# Altium project PorTeL_beacon_board.PrjPcb
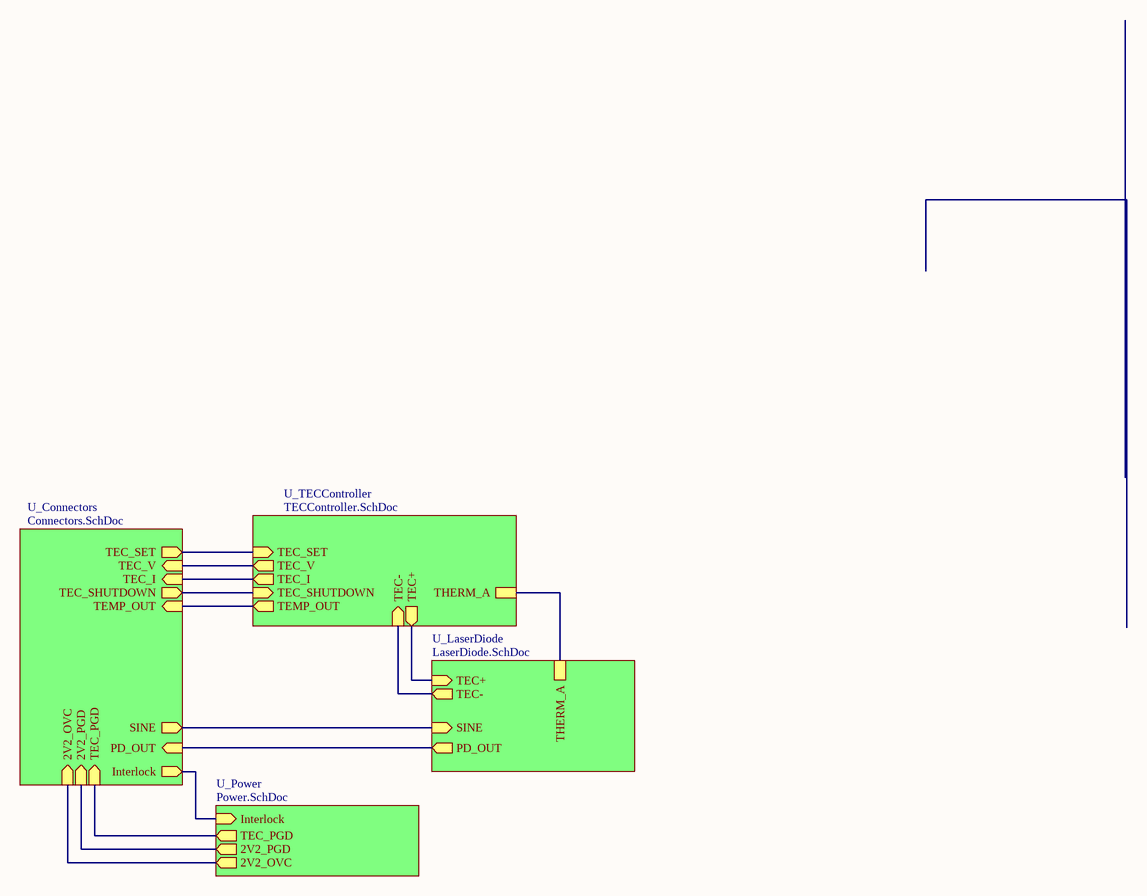
[diagram p0: Top.SchDoc]
drawnby: Nicholas Belsten; Revision: V2.1; title: PorTel-Beacon
5 sheets, 134 parts. Net scope: hierarchical (ports join the sheet entries above them; power ports are global).
Board file: PCB_power.PcbDoc
Sheets:
  Top.SchDoc
    U_Connectors = Connectors.SchDoc
    U_LaserDiode = LaserDiode.SchDoc
    U_Power = Power.SchDoc
    U_TECController = TECController.SchDoc

## Sheet Top.SchDoc: PorTel-Beacon
size Letter; Organization: MIT; SheetNumber: 1; SheetTotal: 5; Section: Section

### Sub-sheets
U_Connectors = Connectors.SchDoc: Interlock (out), SINE (out), TEC_SHUTDOWN (out), PD_OUT (in), TEMP_OUT (in), TEC_I (in), TEC_V (in), TEC_SET (out), 2V2_PGD (in), 2V2_OVC (in), TEC_PGD (in)
U_LaserDiode = LaserDiode.SchDoc: PD_OUT (out), TEC+ (in), TEC- (out), SINE (in), THERM_A
U_Power = Power.SchDoc: Interlock (in), TEC_PGD (out), 2V2_OVC (out), 2V2_PGD (out)
U_TECController = TECController.SchDoc: TEC_I (out), TEC_V (out), TEC_SET (in), TEC+ (out), TEC- (in), TEC_SHUTDOWN (in), TEMP_OUT (out), THERM_A

### Nets
IN2p: sheet U_Connectors/TEC_SET, sheet U_TECController/TEC_SET
OUT1: sheet U_Connectors/TEMP_OUT, sheet U_TECController/TEMP_OUT
OVC: sheet U_Connectors/2V2_OVC, sheet U_Power/2V2_OVC
NetC1_1: sheet U_Connectors/PD_OUT, sheet U_LaserDiode/PD_OUT
NetC54_2: sheet U_LaserDiode/TEC+, sheet U_TECController/TEC+
NetC55_2: sheet U_LaserDiode/TEC-, sheet U_TECController/TEC-
NetJ6_1: sheet U_Connectors/Interlock, sheet U_Power/Interlock
NetR2_2: sheet U_Connectors/SINE, sheet U_LaserDiode/SINE
NetR34_1: sheet U_LaserDiode/THERM_A, sheet U_TECController/THERM_A
NetR55_2: sheet U_Connectors/TEC_SHUTDOWN, sheet U_TECController/TEC_SHUTDOWN
NetR65_1: sheet U_Connectors/TEC_PGD, sheet U_Power/TEC_PGD
NetR69_1: sheet U_Connectors/2V2_PGD, sheet U_Power/2V2_PGD
NetU3_20: sheet U_Connectors/TEC_V, sheet U_TECController/TEC_V
NetU3_21: sheet U_Connectors/TEC_I, sheet U_TECController/TEC_I

### Notes on the sheet
- Title
- Size
- Date
- Letter
- Section
- Time
- Sheet
- of
- Revision
- Drawn
- 33-207 / 77 Mass. Ave.
- Cambridge, MA 02139
- File

## Sheet Connectors.SchDoc: PorTel-Beacon
size Letter; Organization: MIT; SheetNumber: 2; SheetTotal: 5; Section: Connectors
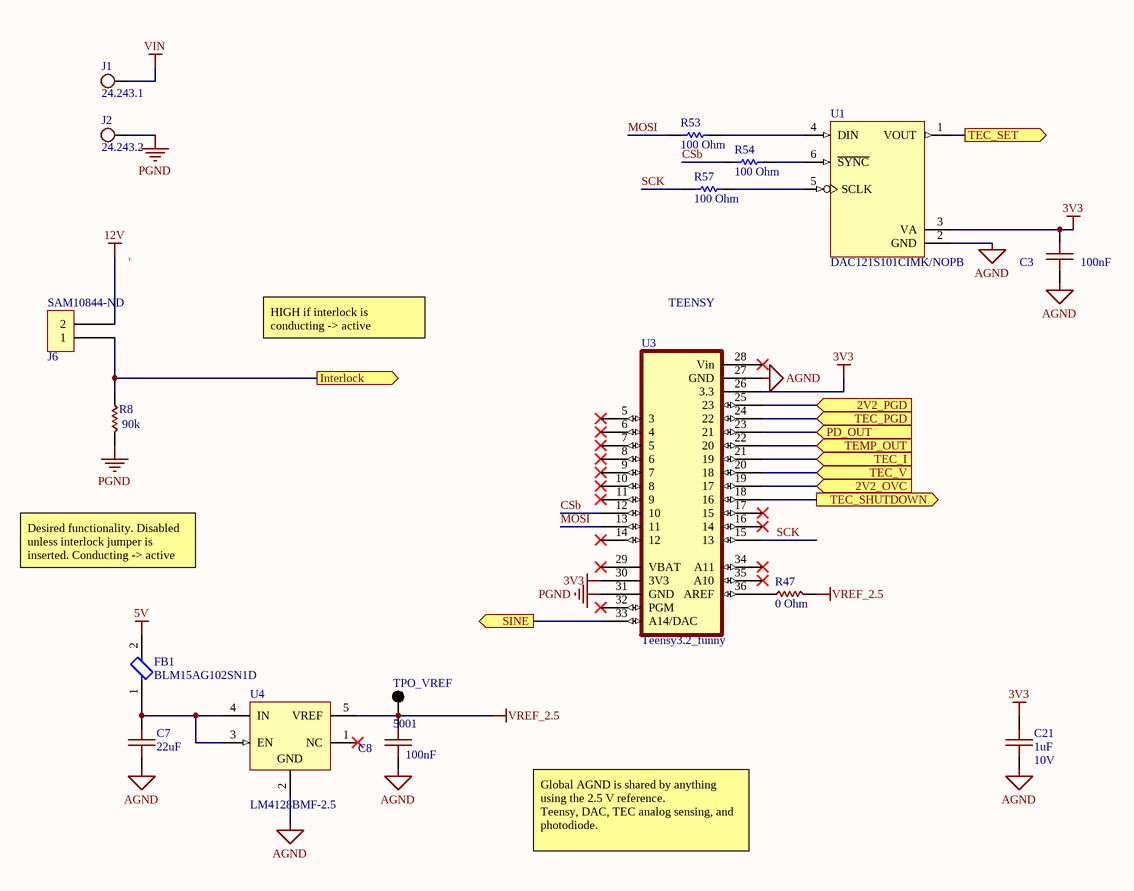
[diagram p1: Connectors.SchDoc]

### Parts
C3  100nF  [0603 B]
C7  22uF  [1210]
C8  100nF  [0603 B]
C21  1uF  Voltage: 10V  [0603 B]
FB1  BLM15AG102SN1D  [FP-BLM15-MFG]
J1  24.243.1  [BANANA RD]  (no BOM)
J2  24.243.2  [BANANA BK]  (no BOM)
J6  Supplier Part Number 1: SAM10844-ND  [SIL02]  (hidden comment: SIL02)
R8  90k  [0603]
R47  0 Ohm  [0603]
R53  100 Ohm  [RESC1608X55X30LL15T15]
R54  100 Ohm  [RESC1608X55X30LL15T15]
R57  100 Ohm  [RESC1608X55X30LL15T15]
TPO_VREF  5001  [KSTN-5001]
U1  DAC121S101CIMK/NOPB  [MK06A_N]
U3  Teensy3.2_funny  [Teensy32_funny]
U4  LM4128BMF-2.5  [DBV0005A_N]

### Ports
2V2_OVC (in), 2V2_PGD (in), Interlock (out), PD_OUT (in), SINE (out), TEC_I (in), TEC_PGD (in), TEC_SET (out), TEC_SHUTDOWN (out), TEC_V (in), TEMP_OUT (in)

### Nets
3V3: C3.1 C21.2 U1.3(VA) U3.26(3.3) U3.30(3V3)
5V: FB1.2
12V: J6.2
AGND: C3.2 C7.2 C8.2 C21.1 U1.2(GND) U3.27(GND) U4.2(GND)
PGND: J2.1(TP) R8.1 U3.31(GND)
VIN: J1.1(TP)
VREF_2.5: C8.1 R47.1 TPO_VREF.1 U4.5(VREF)
CSb: R54.1 U3.12(10)
IN2p: U1.1(VOUT) ; port TEC_SET
MOSI: R53.1 U3.13(11)
OUT1: U3.22(20) ; port TEMP_OUT
OVC: U3.19(17) ; port 2V2_OVC
SCK: R57.1 U3.15(13)
NetC1_1: U3.23(21) ; port PD_OUT
NetC7_1: C7.1 FB1.1 U4.3(EN) U4.4(IN)
NetJ6_1: J6.1 R8.2 ; port Interlock
NetR2_2: U3.33(A14/DAC) ; port SINE
NetR47_2: R47.2 U3.36(AREF)
NetR53_2: R53.2 U1.4(DIN)
NetR54_2: R54.2 U1.6(~{SYNC})
NetR55_2: U3.18(16) ; port TEC_SHUTDOWN
NetR57_2: R57.2 U1.5(SCLK)
NetR65_1: U3.24(22) ; port TEC_PGD
NetR69_1: U3.25(23) ; port 2V2_PGD
NetU3_20: U3.20(18) ; port TEC_V
NetU3_21: U3.21(19) ; port TEC_I

Not connected (* = marked no-connect by the designer): U3 5(3)* 6(4)* 7(5)* 8(6)* 9(7)* 10(8)* 11(9)* 14(12)* 16(14)* 17(15)* 28(Vin)* 29(VBAT)* 32(PGM)* 34(A11)* 35(A10)*; U4 1(NC)*

### Notes on the sheet
- '
- HIGH if interlock is conducting -> active
- TEENSY
- Desired functionality. Disabled unless interlock jumper is inserted. Conducting -> active
- Global AGND is shared by anything using the 2.5 V reference.
  Teensy, DAC, TEC analog sensing, and photodiode.
- Title
- Size
- Date
- Letter
- Section
- Time
- Sheet
- of
- Revision
- Drawn
- 33-207 / 77 Mass. Ave.
- Cambridge, MA 02139
- File

### Library data of the parts
C3 C8 = CAP 0603: 603 Capacitor; Value: 100nF
C7 = CAP 1210: 1210 Capacitor; Value: 22uF
C21 = CAP 0603: 603 Capacitor; Ref: C1608X7R1E105M080AB; Rating: X7R; Value: 1uF
FB1 = CMP-0686-00181-4: FERRITE BEAD 1 KOHM 0402 1LN; Manufacturer: Murata; 3DS Part Number: 310-00007; Impedance At Frequency: 1kΩ @ 100MHz; Tolerance: 25%; Series Resistance: 650mΩ; Test Frequency: 100MHz; Rms Current: 300mA; Manufacturer Part Number: BLM15AG102SN1D; Octopart: https://octopart.com/blm15ag102sn1d-murata-368316; RoHS: TRUE; Ipc Land Pattern Name: CAPC10050X50; Temperature Range High: +125°C; ComponentLink2Description: Datasheet; Device Class L1: Passive Components; Package: BLM15; Temperature Range Low: -55°C; Core Material: Ferrite; ComponentLink2URL: https://www.murata.com/en-us/products/productdata/8796740059166/ENFA0018.pdf?1514431813000; Mouser Description: Ferrite Beads 1K OHM HIGH SPEED SI; Digikey Description: FERRITE BEAD 1 KOHM 0402 1LN; Temperature: -55°C to +125°C; Category: FBead; Device Class L3: Ferrite Beads and Chips; Device Class L2: EMI / RFI Components; Automotive: No; Height: 0.55mm; Lead Free: Yes
J1 = BANANA RED: Banana jack, PCB mount right angle; Ref: 24.243.1
J2 = BANANA BLACK: Banana jack, PCB mount right angle; Ref: 24.243.2
J6 = SIL02: Conn Unshrouded Header HDR 2 POS 2.54mm Solder ST Top Entry Thru-Hole Bag; Manufacturer: Samtec; Manufacturer Part Number: TSW-102-07-F-S; Ref: 4x1 2.54MM HEADER; Number of Contacts: 2; Gender: Male; Max Current Rating: 7.6A; Max Voltage Rating (AC): 550V; Supplier 1: Digi-Key; RoHS: Yes; Category: Headers and Wire Housings; Stock 1: 35041; Pricing 1: 1=0.30000, 10=0.25500, 100=0.19800, 500=0.16968, 1000=0.14140, 5000=0.12120, 10000=0.11312 (USD); Mount: Through Hole; Contact Plating: Gold; Contact Material: Bronze; Color: Black; Housing Color: Black; Housing Material: Polyester; Contact Shape: Square; Contact Finish - Mating: GOLD; Insulation Material: PBT; Insulation Color: Black; Min Operating Temperature: -55°C; Max Operating Temperature: 125°C; Number of Rows: 1; Termination: Solder; Packaging: Bag; Number of Positions: 2; Orientation: Straight; Connector Type: Header; Fastening Type: Pull; Series: TSW; Contact Type: Male Pin; Package Quantity: 1; Length: 5.08mm; Pitch: 2.54mm; Contact Mating Length: 0.23inch; Depth: 2.54mm; Radiation Hardening: No; RoHS Compliant: Yes; Reach SVHC Compliant: Yes; Flammability Rating: UL94 V-0; ComponentLink1URL: https://datasheet.ciiva.com/739/tsw-xxx-xx-xxx-x-xx-xxx-mkt-739881.pdf?src-supplier=Digi-Key; ComponentLink1Description: https://datasheet.ciiva.com/739/tsw-xxx-xx-xxx-x-xx-xxx-mkt-739881.pdf?src-supplier=Digi-Key; ComponentLink2URL: https://datasheet.ciiva.com/10281/htsw-th-10281262.pdf?src-supplier=Avnet; ComponentLink2Description: https://datasheet.ciiva.com/10281/htsw-th-10281262.pdf?src-supplier=Avnet
R8 R47 = RES 0603: 603 Resistor
  R8: Value: 90k
  R47: Value: 0 Ohm
R53 R54 R57 = CMP-2000-00179-1: Manufacturer: Panasonic; Part Number: ERJ-3EKF1000V
TPO_VREF = CMP-2000-05181-1: Test Point, Black, 1-Pin THD, RoHS, Bulk; Manufacturer: Keystone; Other Names: 5001K; Catalog Drawings: 5000Series; Alternate Color: 5004K-ND / -TESTPOINTPCMINI.040"DYELLOW / 5003K-ND / -TESTPOINTPCMINI.040"DORANGE / 5002K-ND / -TESTPOINTPCMINI.040"DWHITE / 5000K-ND / -TESTPOINTPCMINI.040"DRED; Kits: DKTGRS232C-KIT-ND / -TTLCONVERTER; Online Catalog: ColorCodedTestPoints; Datasheet URL: https://ciiva.com/datasheet-click-2917627?src=ciiva&sig=bd195616; Mounting Type: 0.040"(1.02mm)HoleDiameter; Family: TestPoints; RoHS Information: RoHSComplianceStatement; Datasheet Version: Rev. G, 12/2008; Color: Black; Category: TestandMeasurement; Standard Package: 100; Manufacturer URL: http://www.keyelco.com/; Material: Base,Nylon46,UL94V-0; Type: PCTestPoint,Miniature; Terminal: 0.010"x0.020"(0.25mmx0.51mm)PhosphorBronzeWire,SilverPlated; Series: THM; Packaging: Bulk
U1 = CMP-0061-00064-2: 12-Bit Micro Power, RRO Digital-to-Analog Converter, 6-pin Tiny SOT23, Pb-Free; Manufacturer: National Semiconductor; PackageTopMarking: X61C*XTT; CompType: D/A Converter; PowerWise: Y; PinCount: 6; ComponentLink1URL: http://www.national.com/ds/DA/DAC121S101.pdf; Code_JEDEC: MO-193-AA; Code_IPC: SOT26A-6; PackageReference: MK06A; ComponentLink2Description: DAC121S101 Web Page; PackageDescription: Molded TSOT, 2.97 x 1.65 x 0.87mm Body, 6 Lead, 0.95mm Pitch; ComponentLink3Description: MK06A Package Page; ComponentLink1Description: DAC121S101 Datasheet; RoHS: Y; ComponentLink3URL: http://www.national.com/packaging/folders/mk06a.html; PackageVersion: revE, Nov-2008; RevisionNote: Component URLs added; DatasheetVersion: Feb-2010; ComponentLink2URL: http://www.national.com/pf/DA/DAC121S101.html
U4 = CMP-0074-00275-3: Precision Micropower Series Voltage Reference, 5-pin SOT-23; Manufacturer: Texas Instruments; CompType: Voltage Reference IC; PowerWise: Y; PackageTopMarking: R5CB*XTT; PinCount: 5; ComponentLink1Description: Datasheet; PackageReference: DBV0005A; PackageDescription: Molded SOT-23, .115 x .063 x .040 in Body, 5 Lead, .0375 in Pitch; ComponentLink1URL: http://www.ti.com/general/docs/lit/getliterature.tsp?genericPartNumber=LM4128&fileType=pdf; RevisionNote: Component URLs added; DatasheetVersion: Nov-2006; RoHS: N; PackageVersion: revD, Aug-2008

## Sheet LaserDiode.SchDoc: PorTel-Beacon
size Tabloid; Organization: MIT; SheetNumber: 4; SheetTotal: 5; Section: Laser Diode
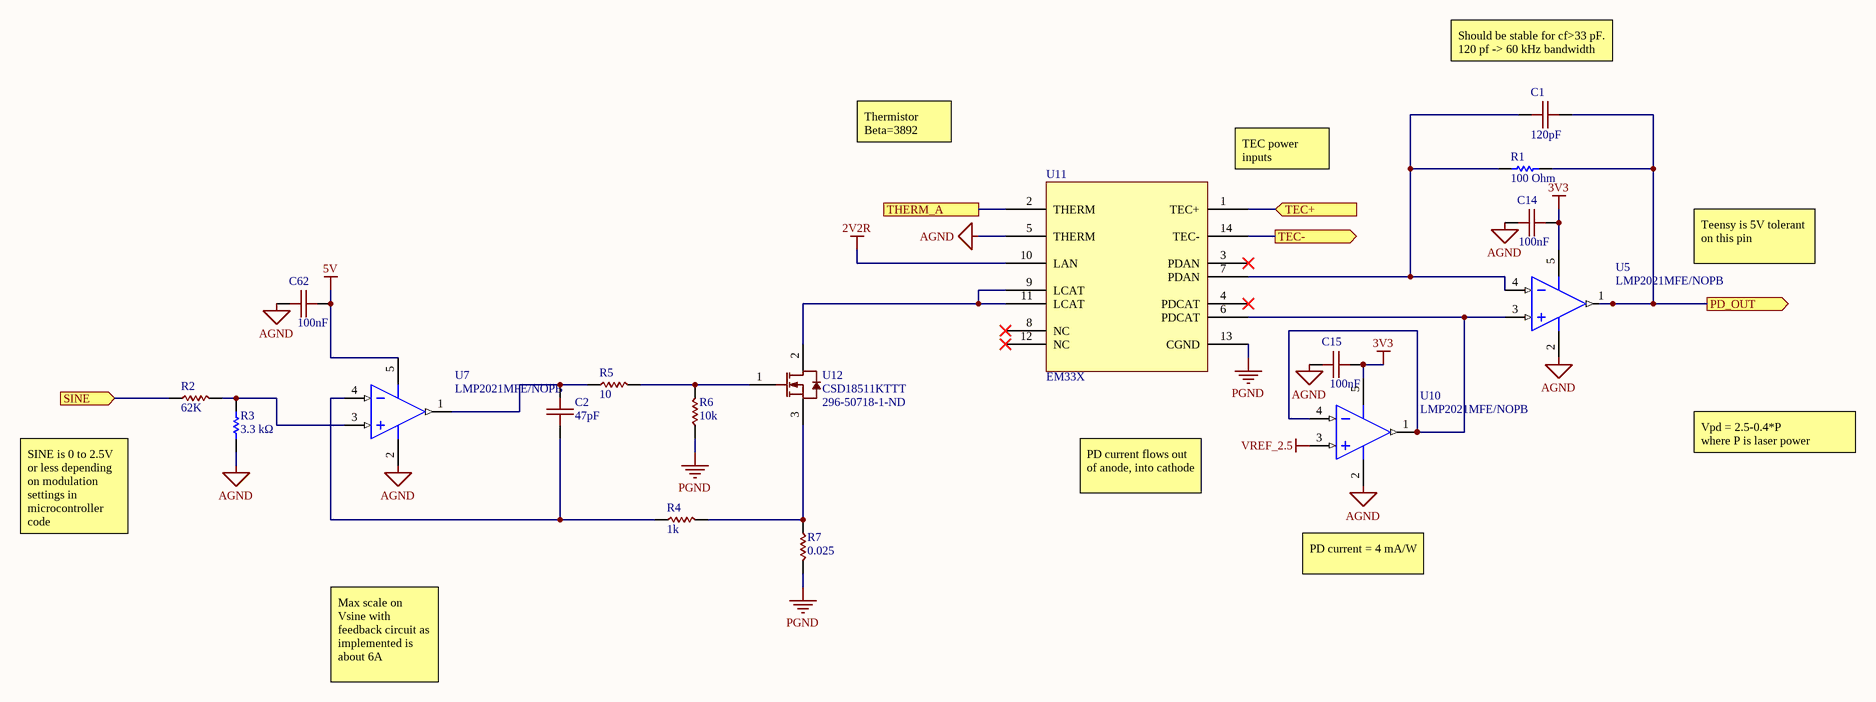
[diagram p2: LaserDiode.SchDoc]

### Parts
C1  120pF  [0603 B]
C2  47pF  [0603 B]
C14  100nF  [0603 B]
C15  100nF  [0603 B]
C62  100nF  [0603 B]
R1  100 Ohm  [RESC1608X55X30LL15T15]
R2  62K  [0805]
R3  3.3 kΩ  [RESC2013X70X40ML20T20]
R4  1k  [0805]
R5  10  [0805]
R6  10k  [0805]
R7  0.025  [1206]
U5  LMP2021MFE/NOPB  [DBV0005A_N]
U7  LMP2021MFE/NOPB  [DBV0005A_N]
U10  LMP2021MFE/NOPB  [DBV0005A_N]
U11  EM33X  [EM33X]
U12  CSD18511KTTT  Supplier Part Number 1: 296-50718-1-ND  [DPAK254P1510X470-3N]

### Ports
PD_OUT (out), SINE (in), TEC+ (in), TEC- (out), THERM_A

### Nets
2V2R: U11.10(LAN)
3V3: C14.1 C15.1 U5.5(V+) U10.5(V+)
5V: C62.1 U7.5(V+)
AGND: C14.2 C15.2 C62.2 R3.1 U5.2(V-) U7.2(V-) U10.2(V-) U11.5(THERM)
PGND: R6.2 R7.1 U11.13(CGND)
VREF_2.5: U10.3(IN+)
NetC1_1: C1.1 R1.2 U5.1(OUT) ; port PD_OUT
NetC1_2: C1.2 R1.1 U5.4(IN-) U11.7(PDAN)
NetC2_1: C2.1 R4.2 U7.4(IN-)
NetC2_2: C2.2 R5.2 U7.1(OUT)
NetC54_2: U11.1(TEC+) ; port TEC+
NetC55_2: U11.14(TEC-) ; port TEC-
NetR2_1: R2.1 R3.2 U7.3(IN+)
NetR2_2: R2.2 ; port SINE
NetR4_1: R4.1 R7.2 U12.3(S)
NetR5_1: R5.1 R6.1 U12.1(G)
NetR34_1: U11.2(THERM) ; port THERM_A
NetU5_3: U5.3(IN+) U10.1(OUT) U10.4(IN-) U11.6(PDCAT)
NetU11_9: U11.9(LCAT) U11.11(LCAT) U12.2(D)

Not connected (* = marked no-connect by the designer): U11 3(PDAN)* 4(PDCAT)* 8(NC)* 12(NC)*

### Notes on the sheet
- Should be stable for cf>33 pF. 120 pf -> 60 kHz bandwidth
- Thermistor Beta=3892
- (near U11) TEC power inputs
- Teensy is 5V tolerant on this pin
- Vpd = 2.5-0.4*P
  where P is laser power
- SINE is 0 to 2.5V or less depending on modulation settings in microcontroller code
- PD current flows out of anode, into cathode
- PD current = 4 mA/W
- Max scale on Vsine with feedback circuit as implemented is about 6A
- Title
- Size
- Date
- Tabloid
- Section
- Time
- Sheet
- of
- Revision
- Drawn
- 33-207 / 77 Mass. Ave.
- Cambridge, MA 02139
- File

### Library data of the parts
C1 = CAP 0603: Cap Ceramic 120pF 50V C0G 5% SMD 0603 125°C Paper T/R; Manufacturer: KEMET; Manufacturer Part Number: C0603C121J5GACTU; Dissipation Factor: 0.1%; Temperature Coefficient: 30ppm/°C; Value: 120pF; Supplier 1: Digi-Key; Supplier Part Number 1: 399-C0603C121J5GAC7867CT-ND; RoHS: Yes; Category: Ceramic Capacitors; Stock 1: 134212; Pricing 1: 1=0.10000, 10=0.04900, 50=0.02660, 100=0.02180, 500=0.01556, 1000=0.01222 (USD); Mount: Surface Mount,PCB; Case/Package: 0603; Number of Pins: 2; Case Code (Metric): 1608; Case Code (Imperial): 0603; Dielectric Material: Ceramic; Contact Material: Tin; Contact Plating: Tin,Matte; Min Operating Temperature: -55°C; Max Operating Temperature: 125°C; Capacitance: 120pF; Tolerance: 5%; Voltage Rating: 50V; Voltage Rating (DC): 50V; Packaging: Tape and Reel; Dielectric: C0G; Series: C; Package Quantity: 1; Termination: SMD/SMT; Construction: Flat; Voltage: 50V; Length: 1.6mm; Width: 0.8mm; Height: 0.8mm; Thickness: 0.034inch; Depth: 0.8mm; Lead Pitch: 0.7mm; Radiation Hardening: No; RoHS Compliant: Yes; Lead Free: Lead Free; Reach SVHC Compliant: Yes; ComponentLink1URL: https://datasheet.ciiva.com/144/docfinderpartnumber-c0603c121j5gactu-144406.pdf?src-supplier=Digi-Key; ComponentLink1Description: https://datasheet.ciiva.com/144/docfinderpartnumber-c0603c121j5gactu-144406.pdf?src-supplier=Digi-Key; ComponentLink2URL: https://datasheet.ciiva.com/14610/70095383-14610090.pdf?src-supplier=Allied+Electronics; ComponentLink2Description: https://datasheet.ciiva.com/14610/70095383-14610090.pdf?src-supplier=Allied+Electronics; ComponentLink3URL: https://datasheet.ciiva.com/5417/kem-c1003-c0g-smd-356956-5417613.pdf?src-supplier=Mouser; ComponentLink3Description: https://datasheet.ciiva.com/5417/kem-c1003-c0g-smd-356956-5417613.pdf?src-supplier=Mouser; ComponentLink4URL: https://datasheet.ciiva.com/18192/getdatasheetpartid-462848-18192773.pdf?src-supplier=Verical; ComponentLink4Description: https://datasheet.ciiva.com/18192/getdatasheetpartid-462848-18192773.pdf?src-supplier=Verical
C2 C14 C15 C62 = CAP 0603: 603 Capacitor
  C2: Value: 47pF
  C14 C15 C62: Value: 100nF
R1 = CMP-2000-00179-1: as R53 on sheet Connectors
R2 R4-R6 = RES 0805: 805 Resistor
  R2: Value: 62K
  R4: Value: 1k
  R5: Value: 10
  R6: Value: 10k
R3 = CMP-2001-00533-1: Manufacturer: Panasonic; Part Number: ERJ6ENF3301V; Resistance: 3.3 kΩ
R7 = RES 1206: 1206 Resistor; Value: 0.025
U5 U7 U10 = CMP-0055-01233-3: Zero Drift, Low Noise, EMI Hardened Amplifier, 5-pin SOT-23, Pb-Free; Manufacturer: Texas Instruments; PowerWise: N; CompType: Amplifiers; PackageTopMarking: AF5A*XTT; PackageDescription: Molded SOT-23, .115 x .063 x .040 in Body, 5 Lead, .0375 in Pitch; PinCount: 5; RoHS: Y; Package Reference: DBV0005A; ComponentLink1URL: http://www.ti.com/general/docs/lit/getliterature.tsp?genericPartNumber=LMP2021&fileType=pdf; ComponentLink1Description: Datasheet URL
U11 = EM33X: 5W Cooled 9XX Multimode Lasers in 14-Pin Package
U12 = CSD18511KTT: 40-V, N channel NexFET™ power MOSFET, single D2PAK, 2.6 mOhm; Vendor: Texas Instruments; Built_By: EMA_Jessica; SourceLibrary: TI_2019-05-10; Manufacturer_Part_Number: CSD18511KTT; Copyright: Copyright (C) 2018 Accelerated Designs. All rights reserved; RefDes: RefDes; Type: DEV; Supplier 1: Digi-Key

## Sheet Power.SchDoc: PorTel-Beacon
size C; Organization: MIT; SheetNumber: 3; SheetTotal: 5; Section: Power
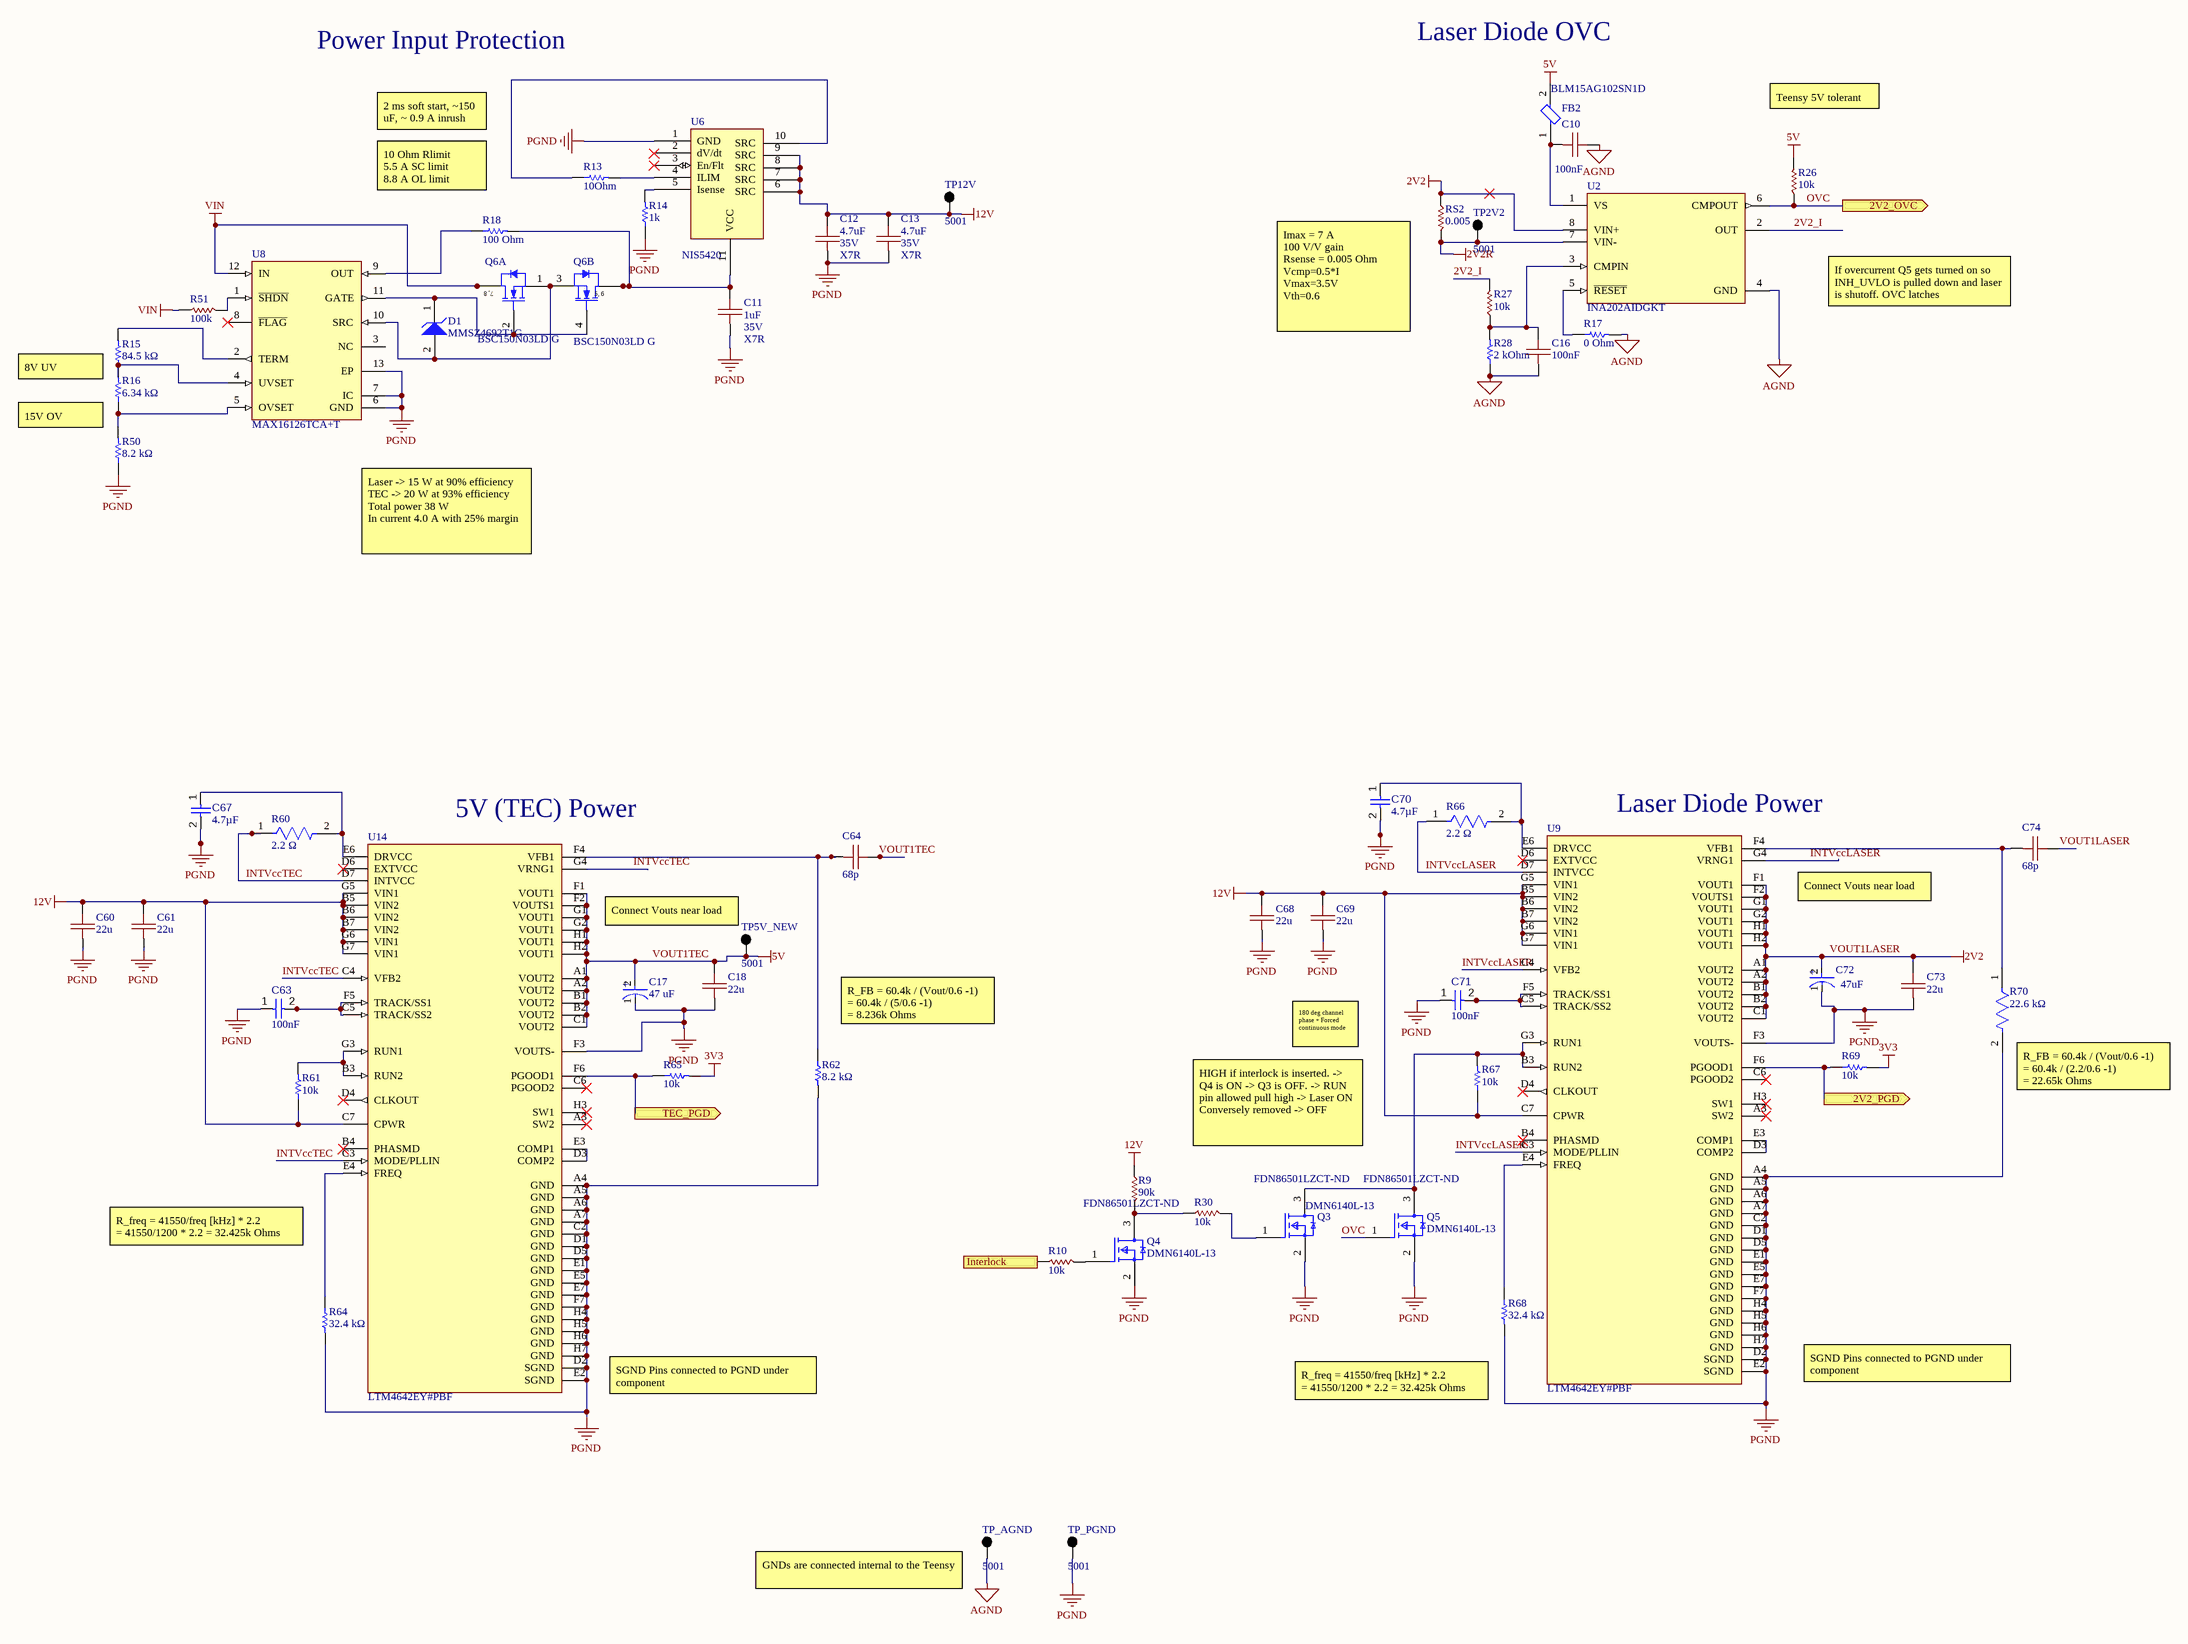
[diagram p3: Power.SchDoc]

### Parts
C10  100nF  [0603 B]
C11  1uF  Voltage: 35V  Type: X7R  [0805 B]
C12  4.7uF  Voltage: 35V  Type: X7R  [0805 B]
C13  4.7uF  Voltage: 35V  Type: X7R  [0805 B]
C16  100nF  [0603 B]
C17  47 uF  [FP-T491D476K025AT-MFG]
C18  22u  [1210]
C60  22u  [1210]
C61  22u  [1210]
C63  value 100nF  [CAPC1005X56X25LL10T15]  (hidden comment: Capacitor 0.1 uF +/- 5% 16 V 0402)
C64  68p  [0805 B]
C67  value 4.7µF  [CAPC0805(2012)145_L]  (hidden comment: Capacitor 4.7µF +/-40% 25V 0805)
C68  22u  [1210]
C69  22u  [1210]
C70  value 4.7µF  [CAPC0805(2012)145_L]  (hidden comment: Capacitor 4.7µF +/-40% 25V 0805)
C71  value 100nF  [CAPC1005X56X25LL10T15]  (hidden comment: Capacitor 0.1 uF +/- 5% 16 V 0402)
C72  Capacitance: 47uF  [FP-T491D476K025AT-MFG]  (hidden comment: 47 uF)
C73  22u  [1210]
C74  68p  [0805 B]
D1  MMSZ4692T1G  [ONSC-SOD-123-2-425-04_V]
FB2  BLM15AG102SN1D  [FP-BLM15-MFG]
Q3  DMN6140L-13  Supplier Part Number 2: FDN86501LZCT-ND  [FP-SOT23-MFG]
Q4  DMN6140L-13  Supplier Part Number 2: FDN86501LZCT-ND  [FP-SOT23-MFG]
Q5  DMN6140L-13  Supplier Part Number 2: FDN86501LZCT-ND  [FP-SOT23-MFG]
Q6  BSC150N03LD G  [INF-PG-TDSON-8-4_V]  (parts A,B of 2)
R9  90k  [0603]
R10  10k  [0603]
R13  10Ohm  [RESC1608X55X25NL10T15]
R14  1k  [RESC1608X55X30LL20T20]
R15  84.5 kΩ  [RESC1609X50X30NL10T20]
R16  6.34 kΩ  [RESC1608X55X30NL15T15]
R17  0 Ohm  [RESC1608X55X25ML10T15]
R18  100 Ohm  [RESC1608X55X30LL15T15]
R26  10k  [0603]
R27  10k  [0805]
R28  2 kOhm  [RESC1608X55X30ML15T15]
R30  10k  [0603]
R50  8.2 kΩ  [RESC1609X50X30NL10T20]
R51  100k  [0603]
R60  2.2 Ω  [FP-CRCW0603-HPe3-IPC_A]
R61  10k  [RESC1608X55X30LL20T20]
R62  8.2 kΩ  [RESC1609X50X30ML10T20]
R64  32.4 kΩ  [RESC1609X50X30LL10T20]
R65  10k  [RESC1608X55X30LL20T20]
R66  2.2 Ω  [FP-CRCW0603-HPe3-IPC_A]
R67  10k  [RESC1608X55X30LL20T20]
R68  32.4 kΩ  [RESC1609X50X30LL10T20]
R69  10k  [RESC1608X55X30LL20T20]
R70  22.6 kΩ  [FP-CRCW0402-e3-IPC_C]
RS2  0.005  [1206]
TP2V2  5001  [KSTN-5001]
TP5V_NEW  5001  [KSTN-5001]
TP12V  5001  [KSTN-5001]
TP_AGND  5001  [KSTN-5001]
TP_PGND  5001  [KSTN-5001]
U2  INA202AIDGKT  [FP-DGK0008A-IPC_A]
U6  NIS5420  [SON50P300X10_HS-11N]
U8  MAX16126TCA+T  [T1233+4_N]
U9  LTM4642EY#PBF  [FP-BGA-56-05-08-1961-MFG]
U14  LTM4642EY#PBF  [FP-BGA-56-05-08-1961-MFG]

### Ports
2V2_OVC (out), 2V2_PGD (out), Interlock (in), TEC_PGD (out)

### Nets
2V2: C72.2(A) C73.2 C74.2 RS2.2 U2.8(VIN+) U9.A1(VOUT2) U9.A2(VOUT2) U9.B1(VOUT2) U9.B2(VOUT2) U9.C1(VOUT2) U9.F1(VOUT1) U9.F2(VOUTS1) U9.G1(VOUT1) U9.G2(VOUT1) U9.H1(VOUT1) U9.H2(VOUT1)  [also labelled VOUT1LASER]
2V2R: RS2.1 TP2V2.1 U2.7(VIN-)
3V3: R65.2 R69.2
5V: C17.2(A) C18.2 C64.2 FB2.2 R26.1 TP5V_NEW.1 U14.A1(VOUT2) U14.A2(VOUT2) U14.B1(VOUT2) U14.B2(VOUT2) U14.C1(VOUT2) U14.F1(VOUT1) U14.F2(VOUTS1) U14.G1(VOUT1) U14.G2(VOUT1) U14.H1(VOUT1) U14.H2(VOUT1)  [also labelled VOUT1TEC]
12V: C12.2 C13.2 C60.2 C61.2 C68.2 C69.2 R9.2 R61.1 R67.1 TP12V.1 U6.6(SRC) U6.7(SRC) U6.8(SRC) U6.9(SRC) U9.B5(VIN2) U9.B6(VIN2) U9.B7(VIN2) U9.C7(CPWR) U9.G5(VIN1) U9.G6(VIN1) U9.G7(VIN1) U14.B5(VIN2) U14.B6(VIN2) U14.B7(VIN2) U14.C7(CPWR) U14.G5(VIN1) U14.G6(VIN1) U14.G7(VIN1)
AGND: C10.2 C16.1 R17.2 R28.1 TP_AGND.1 U2.4(GND)
PGND: C11.1 C12.1 C13.1 C17.1(C) C18.1 C60.1 C61.1 C63.1 C67.2 C68.1 C69.1 C70.2 C71.1 C72.1(C) C73.1 Q3.2(S) Q4.2(S) Q5.2(S) R14.1 R50.1 R62.2 R64.2 R68.2 R70.2 TP_PGND.1 U6.1(GND) U8.6(GND) U8.7(IC) U8.13(EP) U9.A4(GND) U9.A5(GND) U9.A6(GND) U9.A7(GND) U9.C2(GND) U9.D1(GND) U9.D2(SGND) U9.D5(GND) U9.E1(GND) U9.E2(SGND) U9.E5(GND) U9.E7(GND) U9.F3(VOUTS-) U9.F7(GND) U9.H4(GND) U9.H5(GND) U9.H6(GND) U9.H7(GND) U14.A4(GND) U14.A5(GND) U14.A6(GND) U14.A7(GND) U14.C2(GND) U14.D1(GND) U14.D2(SGND) U14.D5(GND) U14.E1(GND) U14.E2(SGND) U14.E5(GND) U14.E7(GND) U14.F3(VOUTS-) U14.F7(GND) U14.H4(GND) U14.H5(GND) U14.H6(GND) U14.H7(GND)
VIN: Q6.7(D1) Q6.8(D1) R51.2 U8.12(IN)
2V2_I: R27.1 U2.2(OUT)
INTVccLASER: R66.1 U9.C3(MODE/PLLIN) U9.C4(VFB2) U9.D7(INTVCC) U9.G4(VRNG1)
INTVccTEC: R60.1 U14.C3(MODE/PLLIN) U14.C4(VFB2) U14.D7(INTVCC) U14.G4(VRNG1)
OVC: Q5.1(G) R26.2 U2.6(CMPOUT) ; port 2V2_OVC
NetC10_1: C10.1 FB2.1 U2.1(VS)
NetC11_2: C11.2 Q6.5(D2) Q6.6(D2) R18.2 U6.11(VCC)
NetC16_2: C16.2 R27.2 R28.2 U2.3(CMPIN)
NetC63_2: C63.2 U14.C5(TRACK/SS2) U14.F5(TRACK/SS1)
NetC64_1: C64.1 R62.1 U14.F4(VFB1)
NetC67_1: C67.1 R60.2 U14.E6(DRVCC)
NetC70_1: C70.1 R66.2 U9.E6(DRVCC)
NetC71_2: C71.2 U9.C5(TRACK/SS2) U9.F5(TRACK/SS1)
NetC74_1: C74.1 R70.1 U9.F4(VFB1)
NetD1_1: D1.1(K) Q6.2(G1) Q6.4(G2) U8.11(GATE)
NetD1_2: D1.2(A) Q6.1(S1) Q6.3(S2) U8.10(SRC)
NetJ6_1: R10.2 ; port Interlock
NetQ3_1: Q3.1(G) R30.1
NetQ3_3: Q3.3(D) Q5.3(D) R67.2 U9.B3(RUN2) U9.G3(RUN1)
NetQ4_1: Q4.1(G) R10.1
NetQ4_3: Q4.3(D) R9.1 R30.2
NetR13_1: R13.1 U6.10(SRC)
NetR13_2: R13.2 U6.4(ILIM)
NetR14_2: R14.2 U6.5(Isense)
NetR15_1: R15.1 R16.2 U8.4(UVSET)
NetR15_2: R15.2 U8.2(TERM)
NetR16_1: R16.1 R50.2 U8.5(OVSET)
NetR17_1: R17.1 U2.5(~{RESET})
NetR18_1: R18.1 U8.9(OUT)
NetR51_1: R51.1 U8.1(~{SHDN})
NetR61_2: R61.2 U14.B3(RUN2) U14.G3(RUN1)
NetR64_1: R64.1 U14.E4(FREQ)
NetR65_1: R65.1 U14.F6(PGOOD1) ; port TEC_PGD
NetR68_1: R68.1 U9.E4(FREQ)
NetR69_1: R69.1 U9.F6(PGOOD1) ; port 2V2_PGD
NetU9_D3: U9.D3(COMP2) U9.E3(COMP1)
NetU14_D3: U14.D3(COMP2) U14.E3(COMP1)

Not connected (* = marked no-connect by the designer): U6 2(dV/dt)* 3(En/Flt)*; U8 3(NC) 8(~{FLAG})*; U9 A3(SW2)* B4(PHASMD)* C6(PGOOD2)* D4(CLKOUT)* D6(EXTVCC)* H3(SW1)*; U14 A3(SW2)* B4(PHASMD)* C6(PGOOD2)* D4(CLKOUT)* D6(EXTVCC)* H3(SW1)*

### Notes on the sheet
- Power Input Protection
- Laser Diode OVC
- 2 ms soft start, ~150 uF, ~ 0.9 A inrush
- Teensy 5V tolerant
- (near R18) 10 Ohm Rlimit
  5.5 A SC limit
  8.8 A OL limit
- If overcurrent Q5 gets turned on so INH_UVLO is pulled down and laser is shutoff. OVC latches
- (near RS2) Imax = 7 A
  100 V/V gain
  Rsense = 0.005 Ohm
  Vcmp=0.5*I
  Vmax=3.5V
  Vth=0.6
- 15V OV
- 8V UV
- Laser -> 15 W at 90% efficiency
  TEC -> 20 W at 93% efficiency
  Total power 38 W
  In current 4.0 A with 25% margin
- (near U14) 5V (TEC) Power
- (near U9) Laser Diode Power
- Connect Vouts near load
- (near TP5V_NEW) Connect Vouts near load
- (near R62) R_FB = 60.4k / (Vout/0.6 -1)
  = 60.4k / (5/0.6 -1)
  = 8.236k Ohms
- 180 deg channel phase + Forced continuous mode
- (near R70) R_FB = 60.4k / (Vout/0.6 -1)
  = 60.4k / (2.2/0.6 -1)
  = 22.65k Ohms
- HIGH if interlock is inserted. -> Q4 is ON -> Q3 is OFF. -> RUN pin allowed pull high -> Laser ON
  Conversely removed -> OFF
- R_freq = 41550/freq [kHz] * 2.2
  = 41550/1200 * 2.2 = 32.425k Ohms
- (near U14) SGND Pins connected to PGND under component
- SGND Pins connected to PGND under component
- (near TP_AGND) GNDs are connected internal to the Teensy
- Title
- Size
- Date
- File
- C
- Section
- Time
- Sheet
- of
- Revision
- Drawn
- 33-207 / 77 Mass. Ave.
- Cambridge, MA 02139
- (in symbol CMP-1090-00073-1, part A) 7, 8
- (in symbol CMP-1090-00073-1, part B) 5, 6
- (in symbol CMP-03017-000020-1) +

### Library data of the parts
C10 C16 = CAP 0603: 603 Capacitor; Value: 100nF
C11-C13 C64 C74 = CAP 0805: 805 Capacitor
  C11: Value: 1uF
  C12 C13: Value: 4.7uF
  C64 C74: Value: 68p
C17 C72 = CMP-03017-000020-1: CAP TANT 47UF 10% 25V 2917; Manufacturer: KEMET; Manufacturer Part Number: T491D476K025AT; Dielectric Material: Tantalum; Life (Hours): 2000Hour; Ripple Current: 463mA; Leakage Current: 11.8uA; Polarity: Polar; ESR (Equivalent Series Resistance): 700mR; Height - Seated (Max): 0.122inch; Package Quantity: 1; Max Operating Temperature: 125°C; Failure Rate: 0.001%; Height: 2.8mm; Voltage Rating (DC): 25V; Dissipation Factor: 10%; Mount: Surface Mount; Min Operating Temperature: -55°C; Packaging: Tape and Reel; Radiation Hardening: No; Case Code (Metric): 7343; Features: General Purpose; Voltage: 25V; Case/Package: 2917; Case Code (Imperial): 2917; Tolerance: 10%; Number of Pins: 2; Weight: 0.023634oz; REACH SVHC: No SVHC; RoHS Compliant: Yes; Length: 7.3mm; Depth: 4.3mm; Lead Free: Lead Free; Width: 4.3mm; Voltage Rating: 25V; Termination: SMD/SMT; Supplier 1: Digi-Key; Supplier Part Number 1: 399-8391-1-ND; RoHS: Yes; Category: Tantalum Capacitors; Stock 1: 66410; Pricing 1: 1=1.63000, 10=1.29000, 50=1.11840, 100=0.96780 (USD); Construction: Flat; Series: T491; Size: 2.8mm; Reach SVHC Compliant: Yes; ComponentLink1URL: https://datasheet.ciiva.com/5934/1776112-5934658.pdf?src-supplier=Farnell; ComponentLink1Description: https://datasheet.ciiva.com/5934/1776112-5934658.pdf?src-supplier=Farnell; ComponentLink2URL: https://datasheet.ciiva.com/27052/1574532-27052600.pdf?src-supplier=Jameco; ComponentLink2Description: https://datasheet.ciiva.com/27052/1574532-27052600.pdf?src-supplier=Jameco; ComponentLink3URL: https://datasheet.ciiva.com/8079/kem-t2005-t491-8079804.pdf?src-supplier=Element14; ComponentLink3Description: https://datasheet.ciiva.com/8079/kem-t2005-t491-8079804.pdf?src-supplier=Element14; ComponentLink4URL: https://datasheet.ciiva.com/7758/1776112-7758986.pdf?src-supplier=Element14; ComponentLink4Description: https://datasheet.ciiva.com/7758/1776112-7758986.pdf?src-supplier=Element14; ComponentLink5URL: https://datasheet.ciiva.com/7758/1776112-7758987.pdf?src-supplier=Element14; ComponentLink5Description: https://datasheet.ciiva.com/7758/1776112-7758987.pdf?src-supplier=Element14; ComponentLink6URL: https://datasheet.ciiva.com/7758/1446014-7758989.pdf?src-supplier=Element14; ComponentLink6Description: https://datasheet.ciiva.com/7758/1446014-7758989.pdf?src-supplier=Element14; ComponentLink7URL: https://datasheet.ciiva.com/22698/1854511-22698959.pdf?src-supplier=Element14; ComponentLink7Description: https://datasheet.ciiva.com/22698/1854511-22698959.pdf?src-supplier=Element14; ComponentLink8URL: https://datasheet.ciiva.com/7758/1698764-7758988.pdf?src-supplier=Element14; ComponentLink8Description: https://datasheet.ciiva.com/7758/1698764-7758988.pdf?src-supplier=Element14; ComponentLink9URL: https://datasheet.ciiva.com/6246/kem-t2005-t491-6246794.pdf?src-supplier=Digi-Key; ComponentLink9Description: https://datasheet.ciiva.com/6246/kem-t2005-t491-6246794.pdf?src-supplier=Digi-Key; ComponentLink10URL: https://datasheet.ciiva.com/6246/kem-t2005-t491-6246791.pdf?src-supplier=Digi-Key; ComponentLink10Description: https://datasheet.ciiva.com/6246/kem-t2005-t491-6246791.pdf?src-supplier=Digi-Key; ComponentLink11URL: https://datasheet.ciiva.com/6246/kem-t2005-t491-6246799.pdf?src-supplier=Digi-Key; ComponentLink11Description: https://datasheet.ciiva.com/6246/kem-t2005-t491-6246799.pdf?src-supplier=Digi-Key; ComponentLink12URL: https://datasheet.ciiva.com/18094/getdatasheetpartid-44077-18094583.pdf?src-supplier=Verical; ComponentLink12Description: https://datasheet.ciiva.com/18094/getdatasheetpartid-44077-18094583.pdf?src-supplier=Verical
  C17: Capacitance: 47uF
C18 C60 C61 C68 C69 C73 = CAP 1210: 1210 Capacitor; Value: 22u
C63 C71 = CMP-001-00001-6: Chip Capacitor, 0.1 uF, +/- 5%, 16 V, 0402 (1005 Metric); Capacitor Type: Ceramic; Voltage Rating: 16V; Max Operating Temperature: 125°C; Min Operating Temperature: -55°C; Case/Package: 0402; Mounting Technology: SM; Pins: 2; Tolerance: 5%; RoHS Compliant: True
C67 C70 = CMP-001-00080-4: Chip Capacitor, 4.7µF +/-40%, 25V, 0805, Thickness 1.45 mm; Tolerance: 20%; Voltage Rating: 25V; Min Operating Temperature: -55°C; Max Operating Temperature: 85°C; Pins: 2; Mounting Technology: SMT; Case/Package: 0805
D1 = CMP-1060-00434-1: Zener Voltage Regulator, 500 mW, 2-Pin SOD-123, Pb-Free, Tape and Reel; Manufacturer: On Semiconductor; VZ Typ (V): 6.8; P Max (W): 0.5; ComponentLink2URL: http://www.onsemi.com/pub_link/Collateral/MMSZ4678T1-D.PDF; Mounting Technology: Surface Mount; DatasheetVersion: Rev. 9; ComponentLink1Description: Manufacturer URL; ComponentLink3URL: http://www.onsemi.com/pub_link/Collateral/425-04.PDF; PackageReference: SOD-123-2-425-04; ComponentLink2Description: Datasheet; RoHS: Pb-Free; Packing: Tape and Reel; ComponentLink1URL: http://www.onsemi.com/; PackageDescription: 2-Pin SOD, Body 1.6 x 2.69 mm; ComponentLink3Description: Package Specification; PartNumber: MMSZ4692T1G; PackageVersion: Rev. G, 10/2009; Supplier 1: Digi-Key; Supplier Part Number 1: MMSZ4692T1GOSCT-ND
FB2 = CMP-0686-00181-4: as FB1 on sheet Connectors; Manufacturer Part Number: BLM15AG102SN1D; Octopart: https://octopart.com/blm15ag102sn1d-murata-368316; RoHS: TRUE; Ipc Land Pattern Name: CAPC10050X50; Temperature Range High: +125°C; ComponentLink2Description: Datasheet; Device Class L1: Passive Components; Package: BLM15; Temperature Range Low: -55°C; Core Material: Ferrite; ComponentLink2URL: https://www.murata.com/en-us/products/productdata/8796740059166/ENFA0018.pdf?1514431813000; Mouser Description: Ferrite Beads 1K OHM HIGH SPEED SI; Digikey Description: FERRITE BEAD 1 KOHM 0402 1LN; Temperature: -55°C to +125°C; Category: FBead; Device Class L3: Ferrite Beads and Chips; Device Class L2: EMI / RFI Components; Automotive: No; Height: 0.55mm; Lead Free: Yes
Q3-Q5 = CMP-12801-000047-1: MOSFET N-CH 60V 1.6A SOT23; Manufacturer: Diodes Inc.; Turn Off Delay Time: 16.3ns; Power Dissipation: 0.7W; Pulse Drain Current: 10A; Number Of Channels: 1; Reverse Recovery Time: 16.8ns; Typ Forward Diode Voltage: 0.75V; Gate To Source Voltage: 20V; Rthja Max: 183°C/W; Gate Charge At Vgs: 8.6nC @ 10V; Drain To Source Resistance: 92mΩ; Depletion Mode: False; Max Junction Temp: +150°C; Max Forward Diode Voltage: 1V; Reverse Recovery Charge: 9nC; Input Capacitace At Vds: 315pF @ 40V; Standoff Height: 0.013mm; Threshold Vgs Max: 3V; Turn On Delay Time: 2.6ns; Mouser Description: MOSFET 31V to 99V N-Ch FET 60Vds 20Vgs 2.3A; ComponentLink2Description: Datasheet; Digikey Description: MOSFET N-CH 60V 1.6A SOT23; Lead Free: Yes; Category: Trans; Device Class L3: MOSFETs; Temperature Range High: +150°C; Octopart: https://octopart.com/dmn6140l-13-diodes+inc.-38898616; Drain To Source Voltage: 60V; ComponentLink2URL: https://www.diodes.com/assets/Datasheets/DMN6140L.pdf; Drain To Source Breakdown Voltage: 60V; Footprint Url: https://www.diodes.com/assets/Package-Files/SOT23.pdf; Package: SOT23; Continuous Drain Current: 1.6A; Device Class L1: Discrete Semiconductors; Device Class L2: Transistors; Number Of N Channels: 1; Temperature Range Low: -55°C; Height: 1.1mm; Manufacturer Part Number: DMN6140L-13; RoHS: TRUE; Temperature: -55°C to +150°C; Threshold Vgs Min: 1V; Automotive: No; Supplier 1: Digi-Key; Supplier 2: Digi-Key
Q6 = CMP-1090-00073-1: N-Channel OptiMOS 3 Power-Transistor, 30 V VDS, 20 A ID, -55 to 150 degC, PG-TDSON-8-4, Reel, Green; Manufacturer: Infineon; ID (max): 20Â A; RthJC (max): 4.9Â K/W; Polarity: N; RDS (on) (max) (@4.5V): 22Â mOhm; RthJA (max): 35 K/W; RDS (on) (max): 15Â mOhm; VDS (max): 30Â V; Ptot (max): 26Â W; VGS(th) (max): 2.2Â V; VGS(th) (min): 1Â V; QG: 4.8Â nC; Green: TRUE; IDpuls (max): 80Â A; ComponentLink2Description: Datasheet; DatasheetVersion: Rev. 1.4; Halogen-free: TRUE; ComponentLink1Description: Manufacturer URL; Mounting Technology: Surface Mount; ComponentLink3Description: Package Specification; ComponentLink3URL: http://www.infineon.com/cms/packages/SMD_-_Surface_Mounted_Devices/P-PG-TDSON/P-PG-TDSON-08-04.html?__locale=en; PackageReference: PG-TDSON-8-4; PackageDescription: 8-Pin Plastic (Green) Thin Dual Small Outline Non-Leaded Package, 5.15 x 5.9 mm Body, 1.27 mm Pitch; Rth: 4.9Â K/W; ComponentLink2URL: http://www.infineon.com/dgdl/BSC150N03LD_rev1.4.pdf?folderId=db3a304313b8b5a60113cee8ed2a02db&fileId=db3a304316f66ee80116fb504a5d729f; PartNumber: BSC150N03LD G; Packing: Reel; PackageVersion: Rev. 03; ComponentLink1URL: http://www.infineon.com/
R9 R10 R26 R30 R51 = RES 0603: 603 Resistor
  R9: Value: 90k
  R10 R26 R30: Value: 10k
  R51: Value: 100k
R13 = CMP-1659-00008-4: Chip Resistor, 10 Ohm, +/- 1%, 0.1 W, -55 to 155 degC, 0603 (1608 Metric), RoHS, Tape and Reel; Manufacturer: Yageo; Voltage Rating: 50 V; PackageReference: 0603; ComponentLink3Description: Package Specification; Packaging: Tape and Reel; Max Operating Temperature: 155 degC; ComponentLink3URL: http://www.farnell.com/datasheets/443971.pdf; PackageDescription: 2-Pin Surface Mount Device, Body 1.6 x 0.8 mm; ComponentLink1URL: http://www.yageo.com/; Pins: 2; REACH SVHC: No SVHC; RoHSCompliant: true; ComponentLink2URL: http://www.yageo.com/documents/recent/PYu-RC_Group_51_RoHS_L_04.pdf; DatasheetVersion: Rev. 4, 02/2016; Mount: Surface Mount; Package Quantity: 200; Min Operating Temperature: -55 degC; Height: 0.45 mm; Mounting Technology: Surface Mount; ComponentLink1Description: Manufacturer URL; ComponentLink2Description: Datasheet; Length: 1.6 mm
R14 R61 R65 R67 R69 = CMP-2000-00873-1: Manufacturer: Panasonic; Part Number: ERA3AEB102V
R15 = CMP-2000-03611-1: Manufacturer: Vishay Dale; Part Number: CRCW060384K5FKEA
R16 = CMP-2000-00600-1: Part Number: ERJ-3EKF6341V; Manufacturer: Panasonic
R17 = CMP-2100-03667-1: Chip Resistor, 0 Ohm, +/- 5%, 0.1 W, -55 to 155 degC, 0603 (1608 Metric), RoHS, Tape and Reel; Manufacturer: Yageo; Temperature Coefficient: 200ppm/degreesC; Voltage Rating: 50V; Power Rating: 100mW; Resistance: 0mOhm; Width: 0.8mm; Max Operating Temperature: 155degC; Tolerance: 5%; Package Reference: 0603; Height: 0.45mm; Depth: 0.8mm; Package Description: 2-Pin Surface Mount Device, Body 1.6 x 0.8 mm; Termination: SMD/SMT; Package Quantity: 5000; Case/Package: 0603; Case Code (Imperial): 0603; Radiation Hardening: No; Number of Pins: 2; Length: 1.6mm; Lead Free: LeadFree; Voltage Rating (DC): 50V; Military Standard: Not; Datasheet URL: http://www.yageo.com/NewPortal/yageodocoutput?fileName=/pdf/R-Chip/PYu-RC_Group_51_RoHS_L_5.pdf; Manufacturer URL: http://www.yageo.com/; Packaging: TapeandReel; Case Code (Metric): 1608; Min Operating Temperature: -55degC; Composition: ThickFilm; RoHSCompliant: true; Contact Plating: Tin; Datasheet Version: Rev. 5, 10/2016; REACH SVHC: NoSVHC
R18 = CMP-2000-00179-1: as R53 on sheet Connectors
R27 = RES 0805: 805 Resistor; Value: 10k
R28 = CMP-2000-00317-1: Part Number: ERJ-3EKF2001V; Manufacturer: Panasonic
R50 R62 = CMP-2000-03620-1: Part Number: CRCW06038K20FKEA; Manufacturer: Vishay Dale
R60 R66 = CMP-02407-007534-1: RES Thick Film, 2.2Ω, 1%, 0.33W, 100ppm/°C, 0603; Power Rating: 250mW; Resistance: 2.2R; Composition: Thick Film; Packaging: Tape and Reel; Case/Package: 0603; Number of Terminations: 2; Max Power Dissipation: 250mW; Max Operating Temperature: 155°C; Tolerance: 1%; Termination: Solder; Lead Free: Lead Free; Length: 1.6mm; Contact Plating: Tin; Case Code (Imperial): 0603; Package Quantity: 5000; Min Operating Temperature: -55°C; Height: 0.022inch; Features: Automotive AEC-Q200; Temperature Coefficient: 100ppm/°C; Case Code (Metric): 1608; Width: 0.033inch; Radiation Hardening: No; Depth: 0.85mm; Mount: Surface Mount
R64 R68 = CMP-2000-03236-1: Manufacturer: Vishay Dale; Part Number: CRCW060332K4FKEA
R70 = CMP-1011-00661-5: RES Thick Film, 22.6kΩ, 1%, 0.063W, 100ppm/°C, 0402; Resistance: 22.6kR; Power Rating: 63mW; Voltage Rating: 50V; Max Operating Temperature: 155°C; Contact Plating: Tin; Case/Package: 0402; Number of Terminations: 2; Radiation Hardening: No; Min Operating Temperature: -55°C; Features: Automotive AEC-Q200; Packaging: Tape and Reel; Weight: 2.3E-05oz; Number of Pins: 2; Composition: Thick Film; Temperature Coefficient: 100ppm/°C; Package Quantity: 10; Case Code (Metric): 1005; Case Code (Imperial): 0402; Military Standard: Not; Termination: SMD/SMT; Max Power Dissipation: 63mW; Height: 0.35mm; Depth: 0.5mm; Width: 0.02inch; Tolerance: 1%; Length: 1mm
RS2 = RES 1206: 1206 Resistor; Value: 0.005; Supplier 1: Digi-Key; Supplier Part Number 1: P.010AUCT-ND
TP2V2 TP5V_NEW TP12V TP_AGND TP_PGND = CMP-2000-05181-1: as TPO_VREF on sheet Connectors; Datasheet URL: https://ciiva.com/datasheet-click-2917627?src=ciiva&sig=bd195616; Mounting Type: 0.040"(1.02mm)HoleDiameter; Family: TestPoints; RoHS Information: RoHSComplianceStatement; Datasheet Version: Rev. G, 12/2008; Color: Black; Category: TestandMeasurement; Standard Package: 100; Manufacturer URL: http://www.keyelco.com/; Material: Base,Nylon46,UL94V-0; Type: PCTestPoint,Miniature; Terminal: 0.010"x0.020"(0.25mmx0.51mm)PhosphorBronzeWire,SilverPlated; Series: THM; Packaging: Bulk
U2 = CMP-04896-000066-1: IC CURRENT MONITOR 3.5% 8VSSOP; Min Supply Voltage: 2.7V; Operating Supply Current: 1.85mA; Bandwidth: 300kHz; Max Supply Voltage: 18V; Mount: Surface Mount; Weight: 0.000935oz; Number of Pins: 8; Packaging: Tape and Reel; Lead Free: Lead Free; Accuracy: 3.5%; Package Quantity: 1; Radiation Hardening: No; Case/Package: VSSOP; Series: -; Max Operating Temperature: 125°C; Min Operating Temperature: -40°C; RoHS Compliant: Yes
U8 = CMP-0251-00243-1: Load-Dump/Reverse-Voltage Protection Circuit, switch-mode fault management, 12-Pin TQFN-EP, -40°C to +125°C, Pb-Free, Tape and Reel; ComponentLink1URL: http://www.maxim-ic.com; PackageReference: T1233+4; ComponentLink2URL: http://datasheets.maxim-ic.com/en/ds/MAX16126-MAX16127.pdf; ComponentLink2Description: Datasheet; PackageVersion: revJ, 2010; ComponentLink1Description: Manufacturer URL; DatasheetVersion: Rev 0, Nov-2011; ComponentLink3URL: http://pdfserv.maxim-ic.com/package_dwgs/21-0136.PDF; ComponentLink3Description: Package Specification; PackageDescription: 12-Pin Thin Quad Flatpack, No Leads, 3 x 3 x 0.75 mm Body, 0.5 mm Pitch, TQFN, Pb-Free; Code_JEDEC: MO-220WEED-1
U9 U14 = CMP-09139-000068-1: DC DC CNVRTR 0.6-5.5V 0.6-5.5V; Min Input Voltage: 4.5V; Current - Output 2: 4A; Voltage - Output 1: 5.5V; Number of Outputs: 2; Switching Frequency: 1.4MHz; Max Input Voltage: 20V; Min Operating Temperature: -40°C; Features: UVLO; Height: 0.19inch; RoHS Compliant: Yes; REACH SVHC: No SVHC; Width: 0.35inch; Current - Output 1: 4A; Mount: Surface Mount; Max Operating Temperature: 125°C; Packaging: Tray; Length: 0.44inch; Case/Package: BGA; Voltage - Output 2: 5.5V; Number of Pins: 56; Max Output Current: 4A

## Sheet TECController.SchDoc: PorTel-Beacon
size Tabloid; Organization: MIT; SheetNumber: 5; SheetTotal: 5; Section: TEC Controller
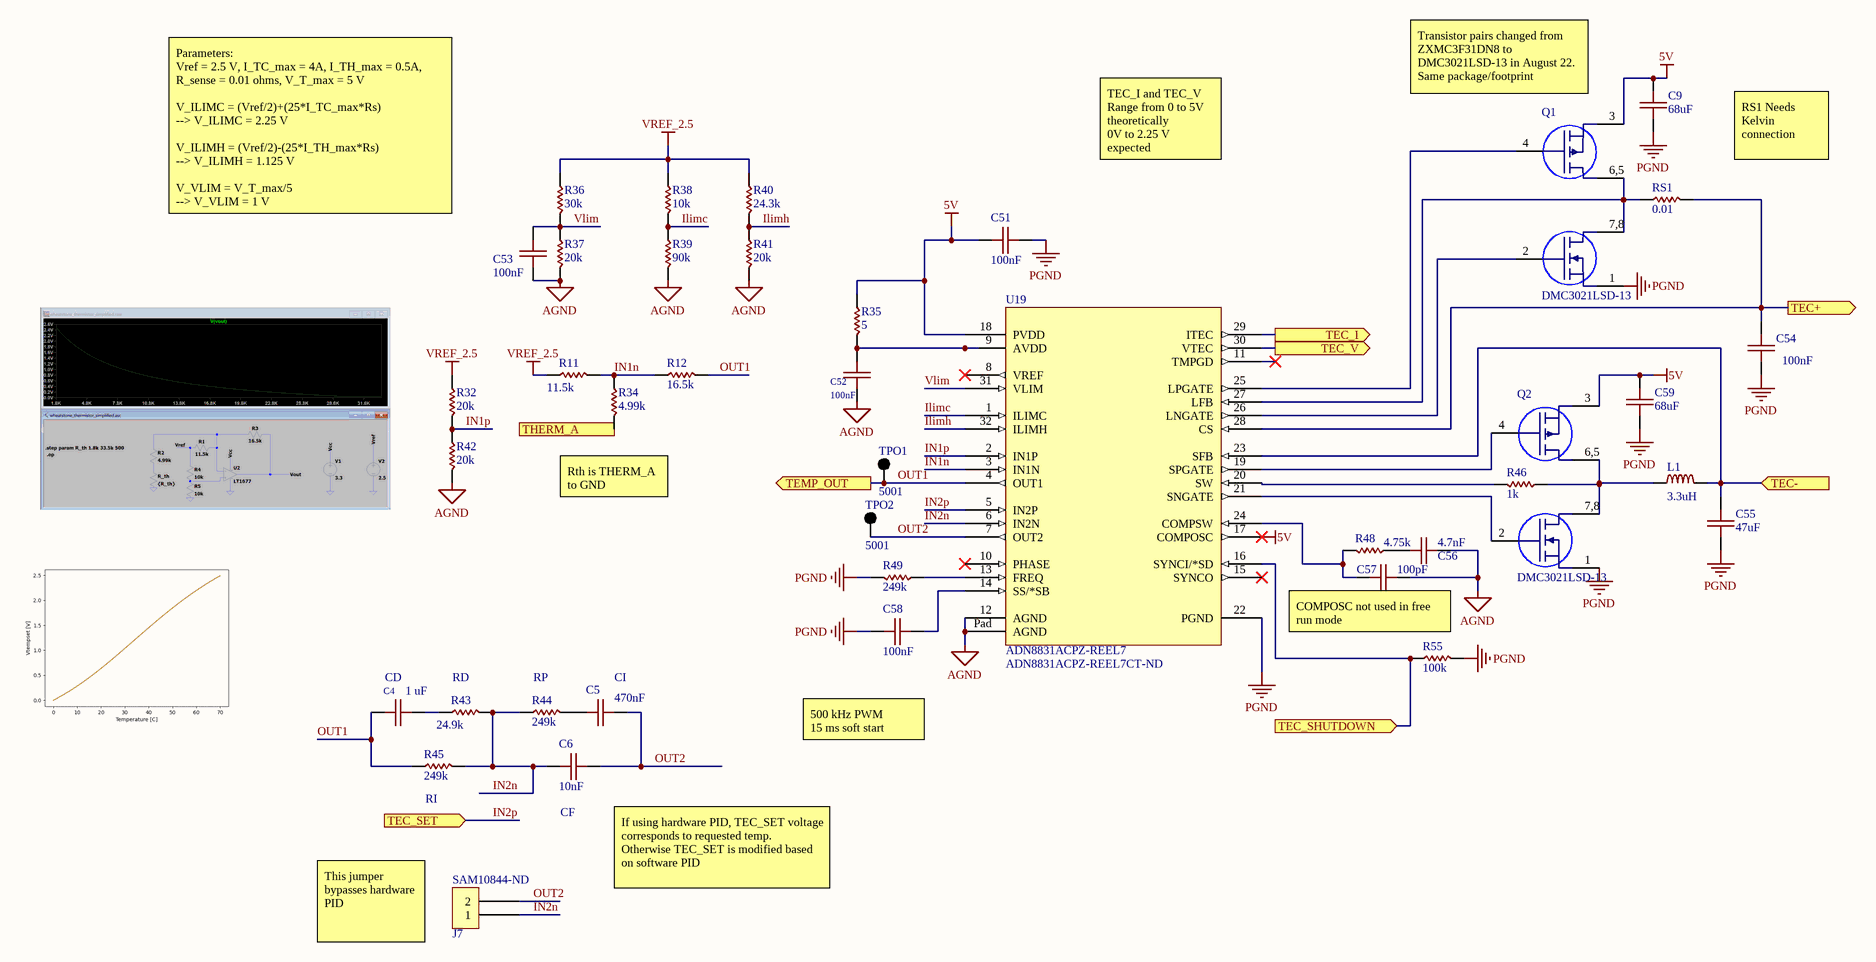
[diagram p4: TECController.SchDoc]

### Parts
C4  value 1 uF  [0603 B]
C5  value 470nF  [0603 B]
C6  10nF  [0603 B]
C9  68uF  [1206 B]
C51  100nF  [0603 B]
C52  100nF  [0603 B]
C53  100nF  [0603 B]
C54  100nF  [0603 B]
C55  47uF  [0805 B]
C56  4.7nF  [0603 B]
C57  100pF  [0603 B]
C58  100nF  [0603 B]
C59  68uF  [1206 B]
J7  Supplier Part Number 1: SAM10844-ND  [SIL02]  (hidden comment: SIL02)
L1  3.3uH  [SRP0520]
Q1  Supplier Part Number 1: DMC3021LSD-13  [SO-8]  (hidden comment: FDS8960C)
Q2  Supplier Part Number 1: DMC3021LSD-13  [SO-8]  (hidden comment: FDS8960C)
R11  value 11.5k  [0603]
R12  16.5k  [0603]
R32  20k  [0603]
R34  4.99k  [0603]
R35  5  [0805]
R36  30k  [0603]
R37  20k  [0603]
R38  10k  [0603]
R39  90k  [0603]
R40  24.3k  [0603]
R41  20k  [0603]
R42  20k  [0603]
R43  24.9k  [0603]
R44  249k  [0603]
R45  249k  [0603]
R46  1k  [0603]
R48  4.75k  [0603]
R49  249k  [0603]
R55  100k  [0603]
RS1  0.01  [1206]
TPO1  5001  [KSTN-5001]
TPO2  5001  [KSTN-5001]
U19  ADN8831ACPZ-REEL7  Supplier Part Number 1: ADN8831ACPZ-REEL7CT-ND  [LFCSP CP 32 7]

### Ports
TEC+ (out), TEC- (in), TEC_I (out), TEC_SET (in), TEC_SHUTDOWN (in), TEC_V (out), TEMP_OUT (out), THERM_A

### Nets
5V: C9.2 C51.1 C59.2 Q1.3 Q2.3 R35.2 U19.17(COMPOSC) U19.18(PVDD)
AGND: C52.2 C53.2 C56.2 C57.2 R37.1 R39.1 R41.1 R42.1 U19.12(AGND) U19.Pad(AGND)
PGND: C9.1 C51.2 C54.1 C55.1 C58.1 C59.1 Q1.1 Q2.1 R49.1 R55.1 U19.22(PGND)
VREF_2.5: R11.2 R32.2 R36.2 R38.2 R40.2
Ilimc: R38.1 R39.2 U19.1(ILIMC)
Ilimh: R40.1 R41.2 U19.32(ILIMH)
IN1n: R11.1 R12.2 R34.2 U19.3(IN1N)
IN1p: R32.1 R42.2 U19.2(IN1P)
IN2n: C6.1 J7.1 R43.1 R44.2 R45.1 U19.6(IN2N)
IN2p: U19.5(IN2P) ; port TEC_SET
OUT1: C4.1 R12.1 R45.2 TPO1.1 U19.4(OUT1) ; port TEMP_OUT
OUT2: C5.2 C6.2 J7.2 TPO2.1 U19.7(OUT2)
Vlim: C53.1 R36.1 R37.2 U19.31(VLIM)
NetC4_2: C4.2 R43.2
NetC5_1: C5.1 R44.1
NetC52_1: C52.1 R35.1 U19.9(AVDD)
NetC54_2: C54.2 RS1.1 U19.28(CS) ; port TEC+
NetC55_2: C55.2 L1.1 U19.23(SFB) ; port TEC-
NetC56_1: C56.1 R48.2
NetC57_1: C57.1 R48.1 U19.24(COMPSW)
NetC58_2: C58.2 U19.14(SS/*SB)
NetL1_2: L1.2 Q2.6,5 Q2.7,8 R46.2
NetQ1_2: Q1.2 U19.26(LNGATE)
NetQ1_4: Q1.4 U19.25(LPGATE)
NetQ1_6,5: Q1.6,5 Q1.7,8 RS1.2 U19.27(LFB)
NetQ2_2: Q2.2 U19.21(SNGATE)
NetQ2_4: Q2.4 U19.19(SPGATE)
NetR34_1: R34.1 ; port THERM_A
NetR46_1: R46.1 U19.20(SW)
NetR49_2: R49.2 U19.13(FREQ)
NetR55_2: R55.2 U19.16(SYNCI/*SD) ; port TEC_SHUTDOWN
NetU3_20: U19.30(VTEC) ; port TEC_V
NetU3_21: U19.29(ITEC) ; port TEC_I

Not connected (* = marked no-connect by the designer): U19 8(VREF)* 10(PHASE)* 11(TMPGD)* 15(SYNCO)*

### Notes on the sheet
- (near Q1) Transistor pairs changed from ZXMC3F31DN8 to DMC3021LSD-13 in August 22. Same package/footprint
- Parameters:
  Vref = 2.5 V, I_TC_max = 4A, I_TH_max = 0.5A, R_sense = 0.01 ohms, V_T_max = 5 V
  V_ILIMC = (Vref/2)+(25*I_TC_max*Rs)
  --> V_ILIMC = 2.25 V
  V_ILIMH = (Vref/2)-(25*I_TH_max*Rs)
  --> V_ILIMH = 1.125 V
  V_VLIM = V_T_max/5
  --> V_VLIM = 1 V
- TEC_I and TEC_V
  Range from 0 to 5V theoretically
  0V to 2.25 V expected
- RS1 Needs Kelvin connection
- (near R34) Rth is THERM_A to GND
- (near C4) CD
- (near R43) RD
- (near R44) RP
- (near C5) CI
- (near C57) COMPOSC not used in free run mode
- 500 kHz PWM
  15 ms soft start
- (near R45) RI
- (near C6) CF
- (near C6) If using hardware PID, TEC_SET voltage corresponds to requested temp. Otherwise TEC_SET is modified based on software PID
- This jumper bypasses hardware PID
- Title
- Size
- Date
- Tabloid
- Section
- Time
- Sheet
- of
- Revision
- Drawn
- 33-207 / 77 Mass. Ave.
- Cambridge, MA 02139
- File

### Library data of the parts
C4-C6 C51-C54 C56-C58 = CAP 0603: 603 Capacitor
  C6: Value: 10nF
  C51-C54 C58: Value: 100nF
  C56: Value: 4.7nF
  C57: Value: 100pF
C9 C59 = CAP 1206: 1206 Capacitor; Value: 68uF
C55 = CAP 0805: 805 Capacitor; Value: 47uF
J7 = SIL02: as J6 on sheet Connectors; Supplier 1: Digi-Key; RoHS: Yes; Category: Headers and Wire Housings; Stock 1: 35041; Pricing 1: 1=0.30000, 10=0.25500, 100=0.19800, 500=0.16968, 1000=0.14140, 5000=0.12120, 10000=0.11312 (USD); Mount: Through Hole; Contact Plating: Gold; Contact Material: Bronze; Color: Black; Housing Color: Black; Housing Material: Polyester; Contact Shape: Square; Contact Finish - Mating: GOLD; Insulation Material: PBT; Insulation Color: Black; Min Operating Temperature: -55°C; Max Operating Temperature: 125°C; Number of Rows: 1; Termination: Solder; Packaging: Bag; Number of Positions: 2; Orientation: Straight; Connector Type: Header; Fastening Type: Pull; Series: TSW; Contact Type: Male Pin; Package Quantity: 1; Length: 5.08mm; Pitch: 2.54mm; Contact Mating Length: 0.23inch; Depth: 2.54mm; Radiation Hardening: No; RoHS Compliant: Yes; Reach SVHC Compliant: Yes; Flammability Rating: UL94 V-0; ComponentLink1URL: https://datasheet.ciiva.com/739/tsw-xxx-xx-xxx-x-xx-xxx-mkt-739881.pdf?src-supplier=Digi-Key; ComponentLink1Description: https://datasheet.ciiva.com/739/tsw-xxx-xx-xxx-x-xx-xxx-mkt-739881.pdf?src-supplier=Digi-Key; ComponentLink2URL: https://datasheet.ciiva.com/10281/htsw-th-10281262.pdf?src-supplier=Avnet; ComponentLink2Description: https://datasheet.ciiva.com/10281/htsw-th-10281262.pdf?src-supplier=Avnet
L1 = IND 3.3uH 4.8A SMD: Bourns SRP0520 3.3uH 4.8A Inductor; Ref: IHLP3232DZER330M11; Value: 3.3uH
Q1 Q2 = DMC3021LSD: Trans Mosfet N/p-ch 30V 8.5A/7A 8-PIN SOIC T/r; Manufacturer: Diodes; Gate to Source Voltage (Vgs): 20V; Rds On Max: 21mR; Input Capacitance: 767pF; Number of Elements: 2; Max Power Dissipation: 2.5W; Continuous Drain Current (ID): 8.5A; Drain to Source Resistance: 14mR; Turn-Off Delay Time: 50.1ns; FET Type: N and P-Channel; Polarity: N-CHANNEL,P-CHANNEL; Supplier 1: Arrow Electronics; Manufacturer Part Number: DMC3021LSD-13; RoHS: Yes; Category: MOSFETs; Stock 1: 2500; Pricing 1: 1=0,52330, 10=0,42450, 25=0,42030, 100=0,30620, 250=0,30310, 500=0,23740, 1000=0,20330 (USD); Mount: Surface Mount; Case/Package: SOIC; Number of Pins: 8; Weight: 0.00261oz; Min Operating Temperature: -55°C; Max Operating Temperature: 150°C; Packaging: Tape and Reel; Package Quantity: 2500; Power Dissipation: 2.5W; Drain to Source Voltage (Vdss): 30V; Number of Channels: 2; Series: -; Length: 4.95mm; Width: 3.95mm; Height: 1.5mm; Radiation Hardening: No; REACH SVHC: No SVHC; RoHS Compliant: Yes; ComponentLink1URL: https://datasheet.ciiva.com/4443/ds32152-88645-4443219.pdf?src-supplier=Mouser; ComponentLink1Description: https://datasheet.ciiva.com/4443/ds32152-88645-4443219.pdf?src-supplier=Mouser; ComponentLink2URL: https://datasheet.ciiva.com/928/ds32152-928775.pdf?src-supplier=Digi-Key; ComponentLink2Description: https://datasheet.ciiva.com/928/ds32152-928775.pdf?src-supplier=Digi-Key; ComponentLink3URL: https://datasheet.ciiva.com/928/ds32152-928776.pdf?src-supplier=Digi-Key; ComponentLink3Description: https://datasheet.ciiva.com/928/ds32152-928776.pdf?src-supplier=Digi-Key; ComponentLink4URL: https://datasheet.ciiva.com/928/ds32152-928777.pdf?src-supplier=Digi-Key; ComponentLink4Description: https://datasheet.ciiva.com/928/ds32152-928777.pdf?src-supplier=Digi-Key
R11 R12 R32 R34 R36-R46 R48 R49 R55 = RES 0603: 603 Resistor
  R12: Value: 16.5k
  R32 R37 R41 R42: Value: 20k
  R34: Value: 4.99k
  R36: Value: 30k
  R38: Value: 10k
  R39: Value: 90k
  R40: Value: 24.3k
  R43: Value: 24.9k
  R44 R45 R49: Value: 249k
  R46: Value: 1k
  R48: Value: 4.75k
  R55: Value: 100k
R35 = RES 0805: 805 Resistor; Value: 5
RS1 = RES 1206: 1206 Resistor; Value: 0.01; Supplier 1: Digi-Key; Supplier Part Number 1: P.010AUCT-ND
TPO1 TPO2 = CMP-2000-05181-1: as TPO_VREF on sheet Connectors; Datasheet URL: https://ciiva.com/datasheet-click-2917627?src=ciiva&sig=bd195616; Mounting Type: 0.040"(1.02mm)HoleDiameter; Family: TestPoints; RoHS Information: RoHSComplianceStatement; Datasheet Version: Rev. G, 12/2008; Color: Black; Category: TestandMeasurement; Standard Package: 100; Manufacturer URL: http://www.keyelco.com/; Material: Base,Nylon46,UL94V-0; Type: PCTestPoint,Miniature; Terminal: 0.010"x0.020"(0.25mmx0.51mm)PhosphorBronzeWire,SilverPlated; Series: THM; Packaging: Bulk
U19 = ADN8831ACPZ-REEL7: A High Efficiency TEC Controller Solution; SourceLibrary: Analog_2015-01-06; Built_By: EMA_UL_Team; Vendor: Analog Devices Inc; Manufacturer_Part_Number: ADN8831ACPZ-REEL7; Copyright: Copyright (C) 2018 Accelerated Designs. All rights reserved; RefDes: RefDes; Type: DEV; Supplier 1: Digi-Key

## Nets that join several sheets
2V2R: LaserDiode (U11.10), Power (RS2.1 TP2V2.1 U2.7)
3V3: Connectors (5 pins), LaserDiode (C14.1 C15.1 U5.5 U10.5), Power (R65.2 R69.2)
5V: Connectors (FB1.2), LaserDiode (C62.1 U7.5), Power (17 pins), TECController (8 pins)
12V: Connectors (J6.2), Power (28 pins)
AGND: Connectors (7 pins), LaserDiode (8 pins), Power (6 pins), TECController (10 pins)
PGND: Connectors (J2.1 R8.1 U3.31), LaserDiode (R6.2 R7.1 U11.13), Power (65 pins), TECController (11 pins)
VIN: Connectors (J1.1), Power (Q6.7 Q6.8 R51.2 U8.12)
VREF_2.5: Connectors (C8.1 R47.1 TPO_VREF.1 U4.5), LaserDiode (U10.3), TECController (5 pins)
IN2p: Connectors (U1.1), TECController (U19.5)
NetC1_1: Connectors (U3.23), LaserDiode (C1.1 R1.2 U5.1)
NetC54_2: LaserDiode (U11.1), TECController (C54.2 RS1.1 U19.28)
NetC55_2: LaserDiode (U11.14), TECController (C55.2 L1.1 U19.23)
NetJ6_1: Connectors (J6.1 R8.2), Power (R10.2)
NetR2_2: Connectors (U3.33), LaserDiode (R2.2)
NetR34_1: LaserDiode (U11.2), TECController (R34.1)
NetR55_2: Connectors (U3.18), TECController (R55.2 U19.16)
NetR65_1: Connectors (U3.24), Power (R65.1 U14.F6)
NetR69_1: Connectors (U3.25), Power (R69.1 U9.F6)
NetU3_20: Connectors (U3.20), TECController (U19.30)
NetU3_21: Connectors (U3.21), TECController (U19.29)
OUT1: Connectors (U3.22), TECController (5 pins)
OVC: Connectors (U3.19), Power (Q5.1 R26.2 U2.6)

## Assembly variants
Populated Components: not fitted C4 C5 C6 R17 R43 R44 R45